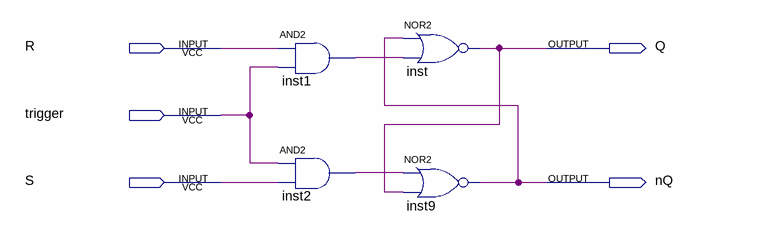
[diagram p0: schematic sheet]
// Quartus schematic latch_sr.bdf as structural Verilog: 4 symbols, 5 pins
module latch_sr (
  input  R,
  input  trigger,
  input  S,
  output Q,
  output nQ
);

  wire inst1_out, inst2_out;

  and inst1 (inst1_out, R, trigger);
  and inst2 (inst2_out, trigger, S);
  nor inst (Q, nQ, inst1_out);
  nor inst9 (nQ, inst2_out, Q);
endmodule
